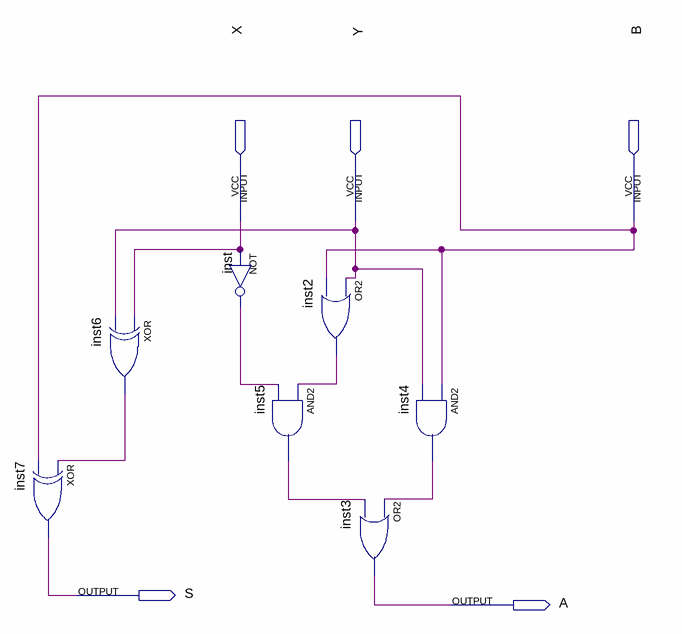
[diagram p0: schematic sheet]
// Quartus schematic Subtrador.bdf as structural Verilog: 7 symbols, 5 pins
module Subtrador (
  input  X,
  input  Y,
  input  B,
  output S,
  output A
);

  wire inst2_out, inst4_out, inst5_out, inst6_out, inst_out;

  xor inst7 (S, inst6_out, B);
  xor inst6 (inst6_out, X, Y);
  not inst (inst_out, X);
  or inst2 (inst2_out, Y, B);
  and inst5 (inst5_out, inst2_out, inst_out);
  or inst3 (A, inst4_out, inst5_out);
  and inst4 (inst4_out, B, Y);
endmodule
